# Altium schematic sheet SW.SchDoc
size A4; SheetNumber: 4; SheetTotal: 5
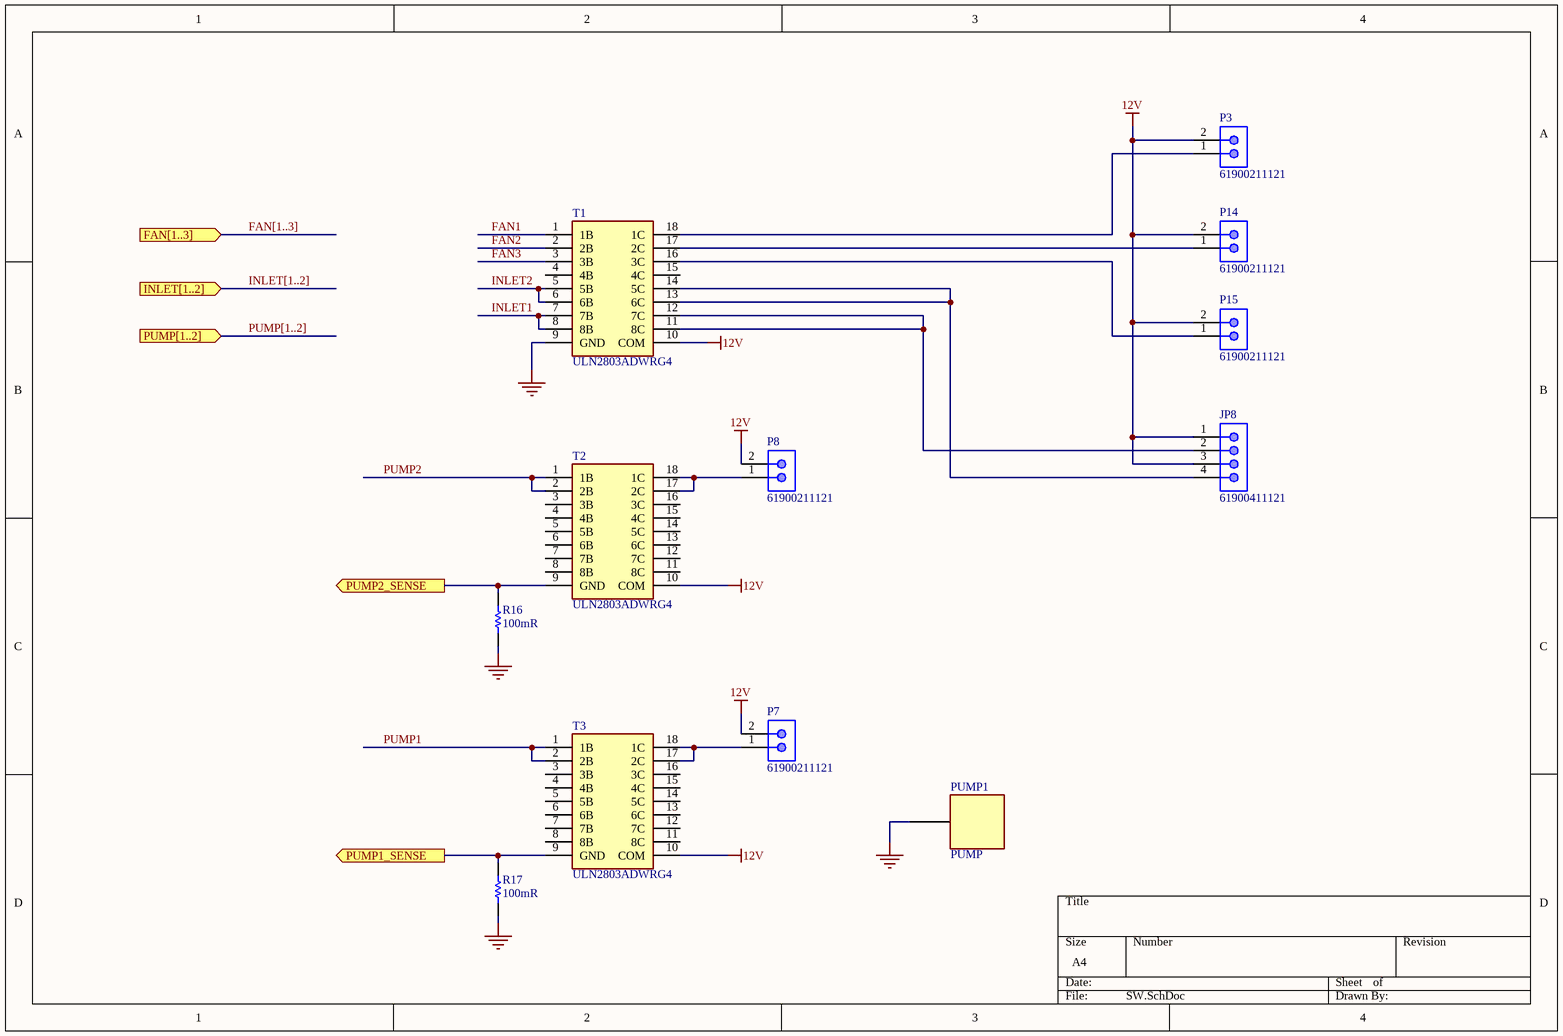
[diagram p0: SW.SchDoc]

## Parts
JP8  61900411121  [61900411121]
P3  61900211121  [61900211121]
P7  61900211121  [61900211121]
P8  61900211121  [61900211121]
P14  61900211121  [61900211121]
P15  61900211121  [61900211121]
PUMP1  PUMP  [PUMP]
R16  value 100mR  [RES_1206_H060 (_IPC_MD)]  (hidden comment: 100mR 1% 0,25W 200V 1206)
R17  value 100mR  [RES_1206_H060 (_IPC_MD)]  (hidden comment: 100mR 1% 0,25W 200V 1206)
T1  ULN2803ADWRG4  [SOIC127P1030X265-18N]
T2  ULN2803ADWRG4  [SOIC127P1030X265-18N]
T3  ULN2803ADWRG4  [SOIC127P1030X265-18N]

## Ports
FAN[1..3] (in), INLET[1..2] (in), PUMP1_SENSE (out), PUMP2_SENSE (out), PUMP[1..2] (in)

## Nets
12V: JP8.1 JP8.3 P3.2 P7.2 P8.2 P14.2 P15.2 T1.10(COM) T2.10(COM) T3.10(COM)
GND: PUMP1.0(CONN) R16.1 R17.1 T1.9(GND)
FAN1: T1.1(1B)
FAN2: T1.2(2B)
FAN3: T1.3(3B)
INLET1: T1.7(7B) T1.8(8B)
INLET2: T1.5(5B) T1.6(6B)
PUMP1: T3.1(1B) T3.2(2B)
PUMP1_SENSE: R17.2 T3.9(GND) ; port PUMP1_SENSE
PUMP2: T2.1(1B) T2.2(2B)
PUMP2_SENSE: R16.2 T2.9(GND) ; port PUMP2_SENSE
NetJP8_2: JP8.2 T1.11(8C) T1.12(7C)
NetJP8_4: JP8.4 T1.13(6C) T1.14(5C)
NetP3_1: P3.1 T1.18(1C)
NetP7_1: P7.1 T3.17(2C) T3.18(1C)
NetP8_1: P8.1 T2.17(2C) T2.18(1C)
NetP14_1: P14.1 T1.17(2C)
NetP15_1: P15.1 T1.16(3C)

Not connected (* = marked no-connect by the designer): T1 4(4B) 15(4C); T2 3(3B) 4(4B) 5(5B) 6(6B) 7(7B) 8(8B) 11(8C) 12(7C) 13(6C) 14(5C) 15(4C) 16(3C); T3 3(3B) 4(4B) 5(5B) 6(6B) 7(7B) 8(8B) 11(8C) 12(7C) 13(6C) 14(5C) 15(4C) 16(3C)

## Buses and harness runs
bus FAN[1..3] = port FAN[1..3]
bus INLET[1..2] = port INLET[1..2]
bus PUMP[1..2] = port PUMP[1..2]

## Library data of the parts
JP8 = 61900411121: WR-WTB THT Male Vertical Locking Header, pitch 2.54mm, 4p; Pin Number: 4; Contact Resistance: 20mOhm; Rated Current: 3A; Withstanding Voltage: 1000VAC; Working Voltage: 250VAC; ComponentLink1Description: Manufacturer; ComponentLink1URL: http://www.we-online.de; ComponentLink2Description: Datasheet; ComponentLink2URL: https://www.we-online.com/catalog/datasheet/61900411121.pdf; Pitch: 2.54mm; Published Date: January 2020; Publisher: Wurth Elektronik; Mounting Technology: THT; Packaging: Bag; Operating Temperature: -40 to +105degC; Part Number: 61900411121; Gender: Male; Type: Vertical
P3 P7 P8 P14 P15 = 61900211121: WR-WTB THT Male Vertical Locking Header, pitch 2.54mm, 2p; Pin Number: 2; Contact Resistance: 20mOhm; Rated Current: 3A; Withstanding Voltage: 1000VAC; Working Voltage: 250VAC; ComponentLink1Description: Manufacturer; ComponentLink1URL: http://www.we-online.de; ComponentLink2Description: Datasheet; ComponentLink2URL: https://www.we-online.com/catalog/datasheet/61900211121.pdf; Pitch: 2.54mm; Published Date: January 2020; Publisher: Wurth Elektronik; Mounting Technology: THT; Packaging: Bag; Operating Temperature: -40 to +105degC; Part Number: 61900211121; Gender: Male; Type: Vertical
R16 R17 = RES100mR1%1206: Designator: R; PCB Lib: MUAB_RES.PcbLib; Scm Lib: Discrete.SchLib; Watt: 0,25W; Tol: 1%; Part Number: RES100mR1%1206; Type: Standard; Volt: 200V; Qty: 1; Supplier 1: Arrow; Supplier 2: Avnet; Supplier 3: Digi-Key; Supplier 4: Distrelec; Supplier 5: Farnell; Supplier 6: Future Electronics; Supplier 7: Mouser; Supplier 8: RSComponents; Supplier 9: Rutronik; Supplier 10: SEED OPL
T1-T3 = ULN2803ADWRG4: Darlington; Manufacturer_Name: Texas Instruments; Datasheet Link: http://www.ti.com/lit/ds/symlink/uln2803a.pdf; Height: 2.65mm; Manufacturer_Part_Number: ULN2803ADWRG4; Mouser Part Number: 595-ULN2803ADWRG4; Mouser Price/Stock: https://www.mouser.co.uk/ProductDetail/Texas-Instruments/ULN2803ADWRG4?qs=pbofycSusePr3zMQZfJ%2FRA%3D%3D; Arrow Part Number: ULN2803ADWRG4; Arrow Price/Stock: https://www.arrow.com/en/products/uln2803adwrg4/texas-instruments; Supplier 1: Mouser; Supplier Part Number 1: 595-ULN2803ADWRG4